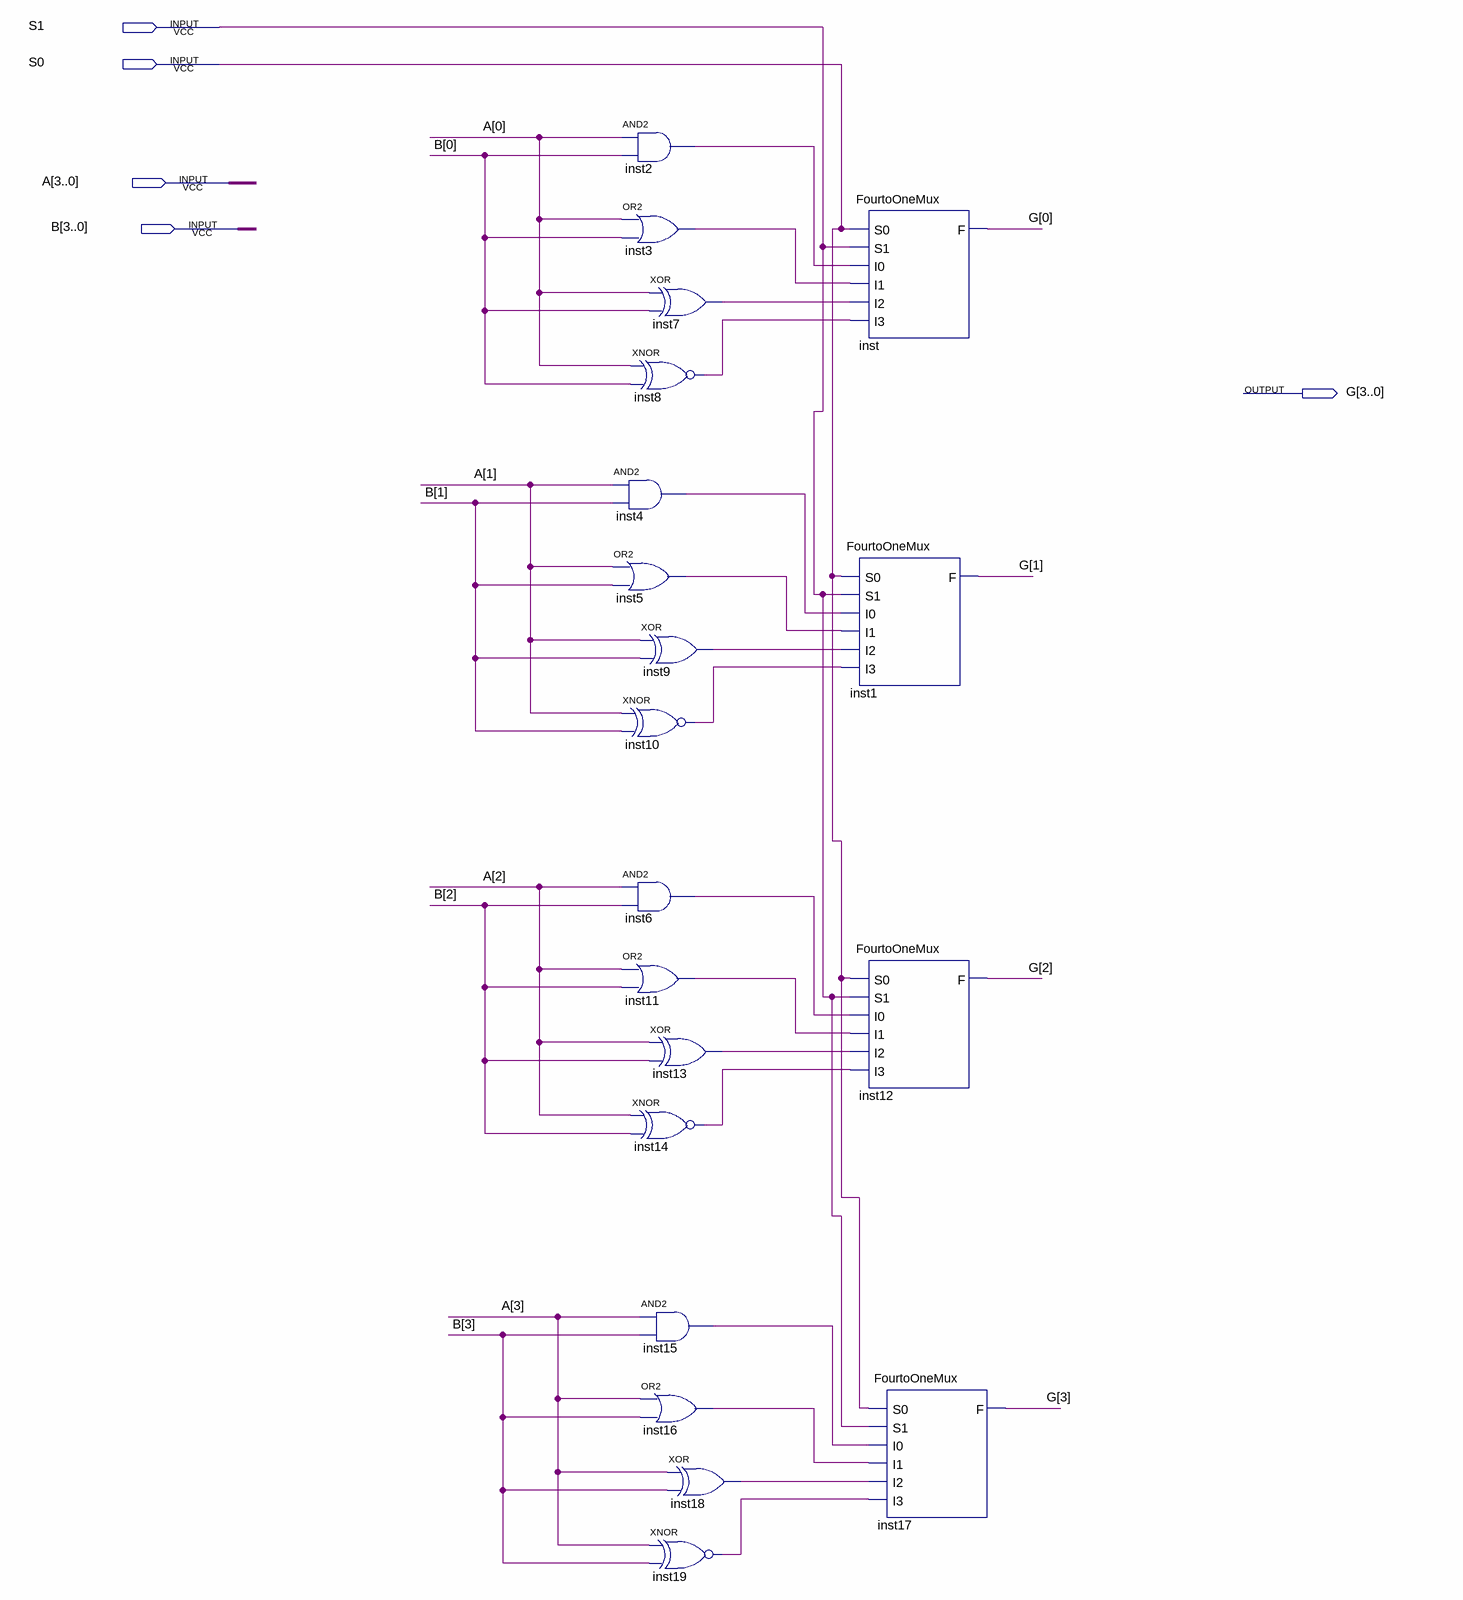
[diagram p0: schematic sheet]
// Quartus schematic AndOrXorXnor.bdf as structural Verilog: 20 symbols, 5 pins
module AndOrXorXnor (
  input  S1,
  input  S0,
  input  [3:0] A,
  input  [3:0] B,
  output [3:0] G
);

  wire inst2_out, inst3_out, inst4_out, inst5_out, inst6_out, inst7_out, inst8_out, inst9_out, inst10_out,
       inst11_out, inst13_out, inst14_out, inst15_out, inst16_out, inst18_out, inst19_out;

  and inst2 (inst2_out, A[0], B[0]);
  or inst3 (inst3_out, A[0], B[0]);
  xor inst7 (inst7_out, A[0], B[0]);
  xnor inst8 (inst8_out, A[0], B[0]);
  and inst4 (inst4_out, A[1], B[1]);
  or inst5 (inst5_out, A[1], B[1]);
  xor inst9 (inst9_out, A[1], B[1]);
  xnor inst10 (inst10_out, A[1], B[1]);
  and inst6 (inst6_out, A[2], B[2]);
  or inst11 (inst11_out, A[2], B[2]);
  xor inst13 (inst13_out, A[2], B[2]);
  xnor inst14 (inst14_out, A[2], B[2]);
  and inst15 (inst15_out, A[3], B[3]);
  or inst16 (inst16_out, A[3], B[3]);
  xor inst18 (inst18_out, A[3], B[3]);
  xnor inst19 (inst19_out, A[3], B[3]);
  FourtoOneMux inst (.S0(S0), .S1(S1), .I0(inst2_out), .I1(inst3_out), .I2(inst7_out), .I3(inst8_out), .F(G[0]));
  FourtoOneMux inst1 (.S0(S0), .S1(S1), .I0(inst4_out), .I1(inst5_out), .I2(inst9_out), .I3(inst10_out), .F(G[1]));
  FourtoOneMux inst12 (.S0(S0), .S1(S1), .I0(inst6_out), .I1(inst11_out), .I2(inst13_out), .I3(inst14_out), .F(G[2]));
  FourtoOneMux inst17 (.S0(S0), .S1(S1), .I0(inst15_out), .I1(inst16_out), .I2(inst18_out), .I3(inst19_out), .F(G[3]));
endmodule
